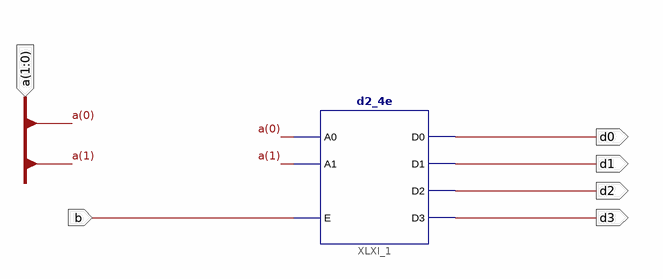
[diagram p0: schematic sheet 1]
// Xilinx ISE schematic decoderWrite8Bit.sch (spartan6) as structural Verilog: 1 symbols, 6 ports
module decoderWrite8Bit (
  input  [1:0] a,
  input  b,
  output d0,
  output d1,
  output d2,
  output d3
);

  d2_4e XLXI_1 (.A0(a[0]), .A1(a[1]), .E(b), .D0(d0), .D1(d1), .D2(d2), .D3(d3));
endmodule
